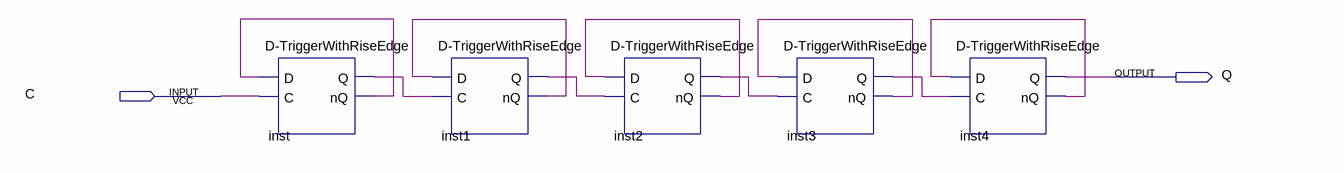
[diagram p0: schematic sheet]
// Quartus schematic D-Trigger5.bdf as structural Verilog: 5 symbols, 2 pins
module \D-Trigger5  (
  input  C,
  output Q
);

  wire inst1_nq, inst1_q, inst2_nq, inst2_q, inst3_nq, inst3_q, inst4_nq, inst_nq, inst_q;

  \D-TriggerWithRiseEdge  inst (.D(inst_nq), .C(C), .Q(inst_q), .nQ(inst_nq));
  \D-TriggerWithRiseEdge  inst1 (.D(inst1_nq), .C(inst_q), .Q(inst1_q), .nQ(inst1_nq));
  \D-TriggerWithRiseEdge  inst2 (.D(inst2_nq), .C(inst1_q), .Q(inst2_q), .nQ(inst2_nq));
  \D-TriggerWithRiseEdge  inst3 (.D(inst3_nq), .C(inst2_q), .Q(inst3_q), .nQ(inst3_nq));
  \D-TriggerWithRiseEdge  inst4 (.D(inst4_nq), .C(inst3_q), .Q(Q), .nQ(inst4_nq));
endmodule
